# Altium schematic sheet POWER.SchDoc
size A4; SheetNumber: 1; SheetTotal: 2
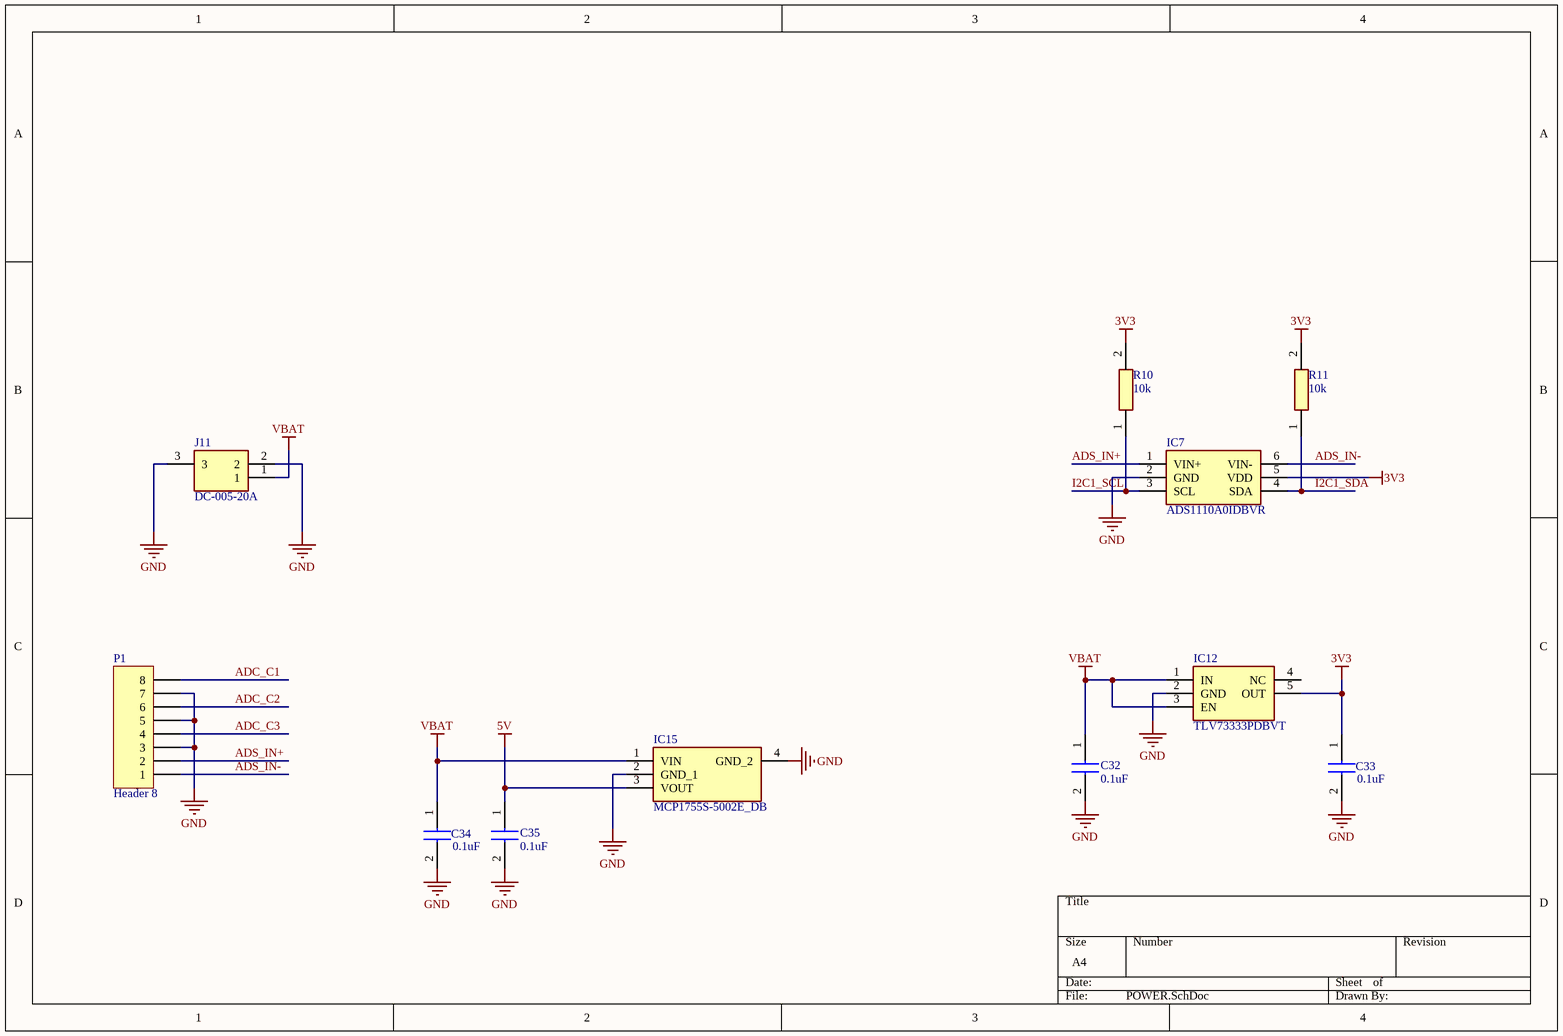
[diagram p0: POWER.SchDoc]

## Parts
C32  0.1uF  [CAPC2012X94N]
C33  0.1uF  [CAPC2012X94N]
C34  0.1uF  [CAPC2012X94N]
C35  0.1uF  [CAPC2012X94N]
IC7  ADS1110A0IDBVR  [SOT95P280X145-6N]
IC12  TLV73333PDBVT  [SOT95P280X145-5N]
IC15  MCP1755S-5002E_DB  [SOT230P700X180-4N]
J11  DC-005-20A  [DC00520A]
P1  Header 8  [HDR1X8]
R10  10k  [RESC2012X65N]
R11  10k  [RESC2012X65N]

## Nets
3V3: C33.1 IC7.5(VDD) IC12.5(OUT) R10.2 R11.2
5V: C35.1 IC15.3(VOUT)
GND: C32.2 C33.2 C34.2 C35.2 IC7.2(GND) IC12.2(GND) IC15.2(GND_1) IC15.4(GND_2) J11.2 J11.3 P1.3 P1.5 P1.7
VBAT: C32.1 C34.1 IC12.1(IN) IC12.3(EN) IC15.1(VIN) J11.1
ADC_C1: P1.8
ADC_C2: P1.6
ADC_C3: P1.4
ADS_IN+: IC7.1(VIN+) P1.2
ADS_IN-: IC7.6(VIN-) P1.1
I2C1_SCL: IC7.3(SCL) R10.1
I2C1_SDA: IC7.4(SDA) R11.1

Not connected (* = marked no-connect by the designer): IC12 4(NC)

## Library data of the parts
C32-C35 = 08055A130JAT2A: Capacitor; Manufacturer_Name: AVX; Datasheet Link: https://componentsearchengine.com/Datasheets/1/06031A100FAT2A.pdf; Height: 0.94mm; Manufacturer_Part_Number: 08055A130JAT2A; Mouser Part Number: 581-08055A130JAT2A; Mouser Price/Stock: https://www.mouser.com/Search/Refine.aspx?Keyword=581-08055A130JAT2A
IC7 = ADS1110A0IDBVR: Integrated Circuit; Manufacturer_Name: Texas Instruments; Datasheet Link: http://www.ti.com/lit/gpn/ADS1110; Height: 1.45mm; Manufacturer_Part_Number: ADS1110A0IDBVR; Mouser Part Number: 595-ADS1110A0IDBVR; Mouser Price/Stock: https://www.mouser.co.uk/ProductDetail/Texas-Instruments/ADS1110A0IDBVR?qs=RaXRGs7zCv6DNsu6ZxMmcw%3D%3D; Arrow Part Number: ADS1110A0IDBVR; Arrow Price/Stock: https://www.arrow.com/en/products/ads1110a0idbvr/texas-instruments?region=nac
IC12 = TLV73333PDBVT: Integrated Circuit; Manufacturer_Name: Texas Instruments; Datasheet Link: http://www.ti.com/lit/ds/symlink/tlv733p.pdf; Height: 1.45mm; Manufacturer_Part_Number: TLV73333PDBVT; Mouser Part Number: 595-TLV73333PDBVT; Mouser Price/Stock: https://www.mouser.co.uk/ProductDetail/Texas-Instruments/TLV73333PDBVT?qs=ifm8N2Kdrcam8xfmi4tOsQ%3D%3D; Arrow Part Number: TLV73333PDBVT; Arrow Price/Stock: https://www.arrow.com/en/products/tlv73333pdbvt/texas-instruments
IC15 = MCP1755S-5002E_DB: Integrated Circuit; Manufacturer_Name: Microchip; Manufacturer_Part_Number: MCP1755S-5002E/DB; Datasheet Link: https://componentsearchengine.com/Datasheets/2/MCP1755S-5002E_DB.pdf; Height: 1.8mm; Mouser Part Number: 579-MCP1755S-5002EDB; Mouser Price/Stock: https://www.mouser.co.uk/ProductDetail/Microchip-Technology/MCP1755S-5002E-DB?qs=OCR3PNzn1cf4RZNBCd4jZw%3D%3D; Arrow Part Number: MCP1755S-5002E/DB; Arrow Price/Stock: https://www.arrow.com/en/products/mcp1755s-5002edb/microchip-technology
J11 = DC-005-20A: Connector; Manufacturer_Name: Korean Hroparts Elec; Datasheet Link: https://datasheet.lcsc.com/szlcsc/Korean-Hroparts-Elec-DC-005-20A_C130239.pdf; Height: 11mm; Manufacturer_Part_Number: DC-005-20A
P1 = Header 8: Header, 8-Pin; LatestRevisionDate: 17-Jul-2002; LatestRevisionNote: Re-released for DXP Platform.; Publisher: Altium Limited
R10 R11 = CPF0805B102RE1: Resistor; Manufacturer_Name: TE Connectivity; Datasheet Link: https://datasheet.datasheetarchive.com/originals/distributors/DKDS-21/401696.pdf; Height: 0.65mm; Manufacturer_Part_Number: CPF0805B102RE1